# Altium schematic sheet RF_in_v2.SchDoc: Приемопередатчик  SDR200
size 420 x 297 mm; Author: В.Титов; DrawnBy: В.Титов; DocumentNumber: ХХХХ.468179.001 Э3; SheetNumber: 2; SheetTotal: 3; DocumentType: Схема электрическая принципиальная; Title2: Радиочастотная плата; Scale: 1:1
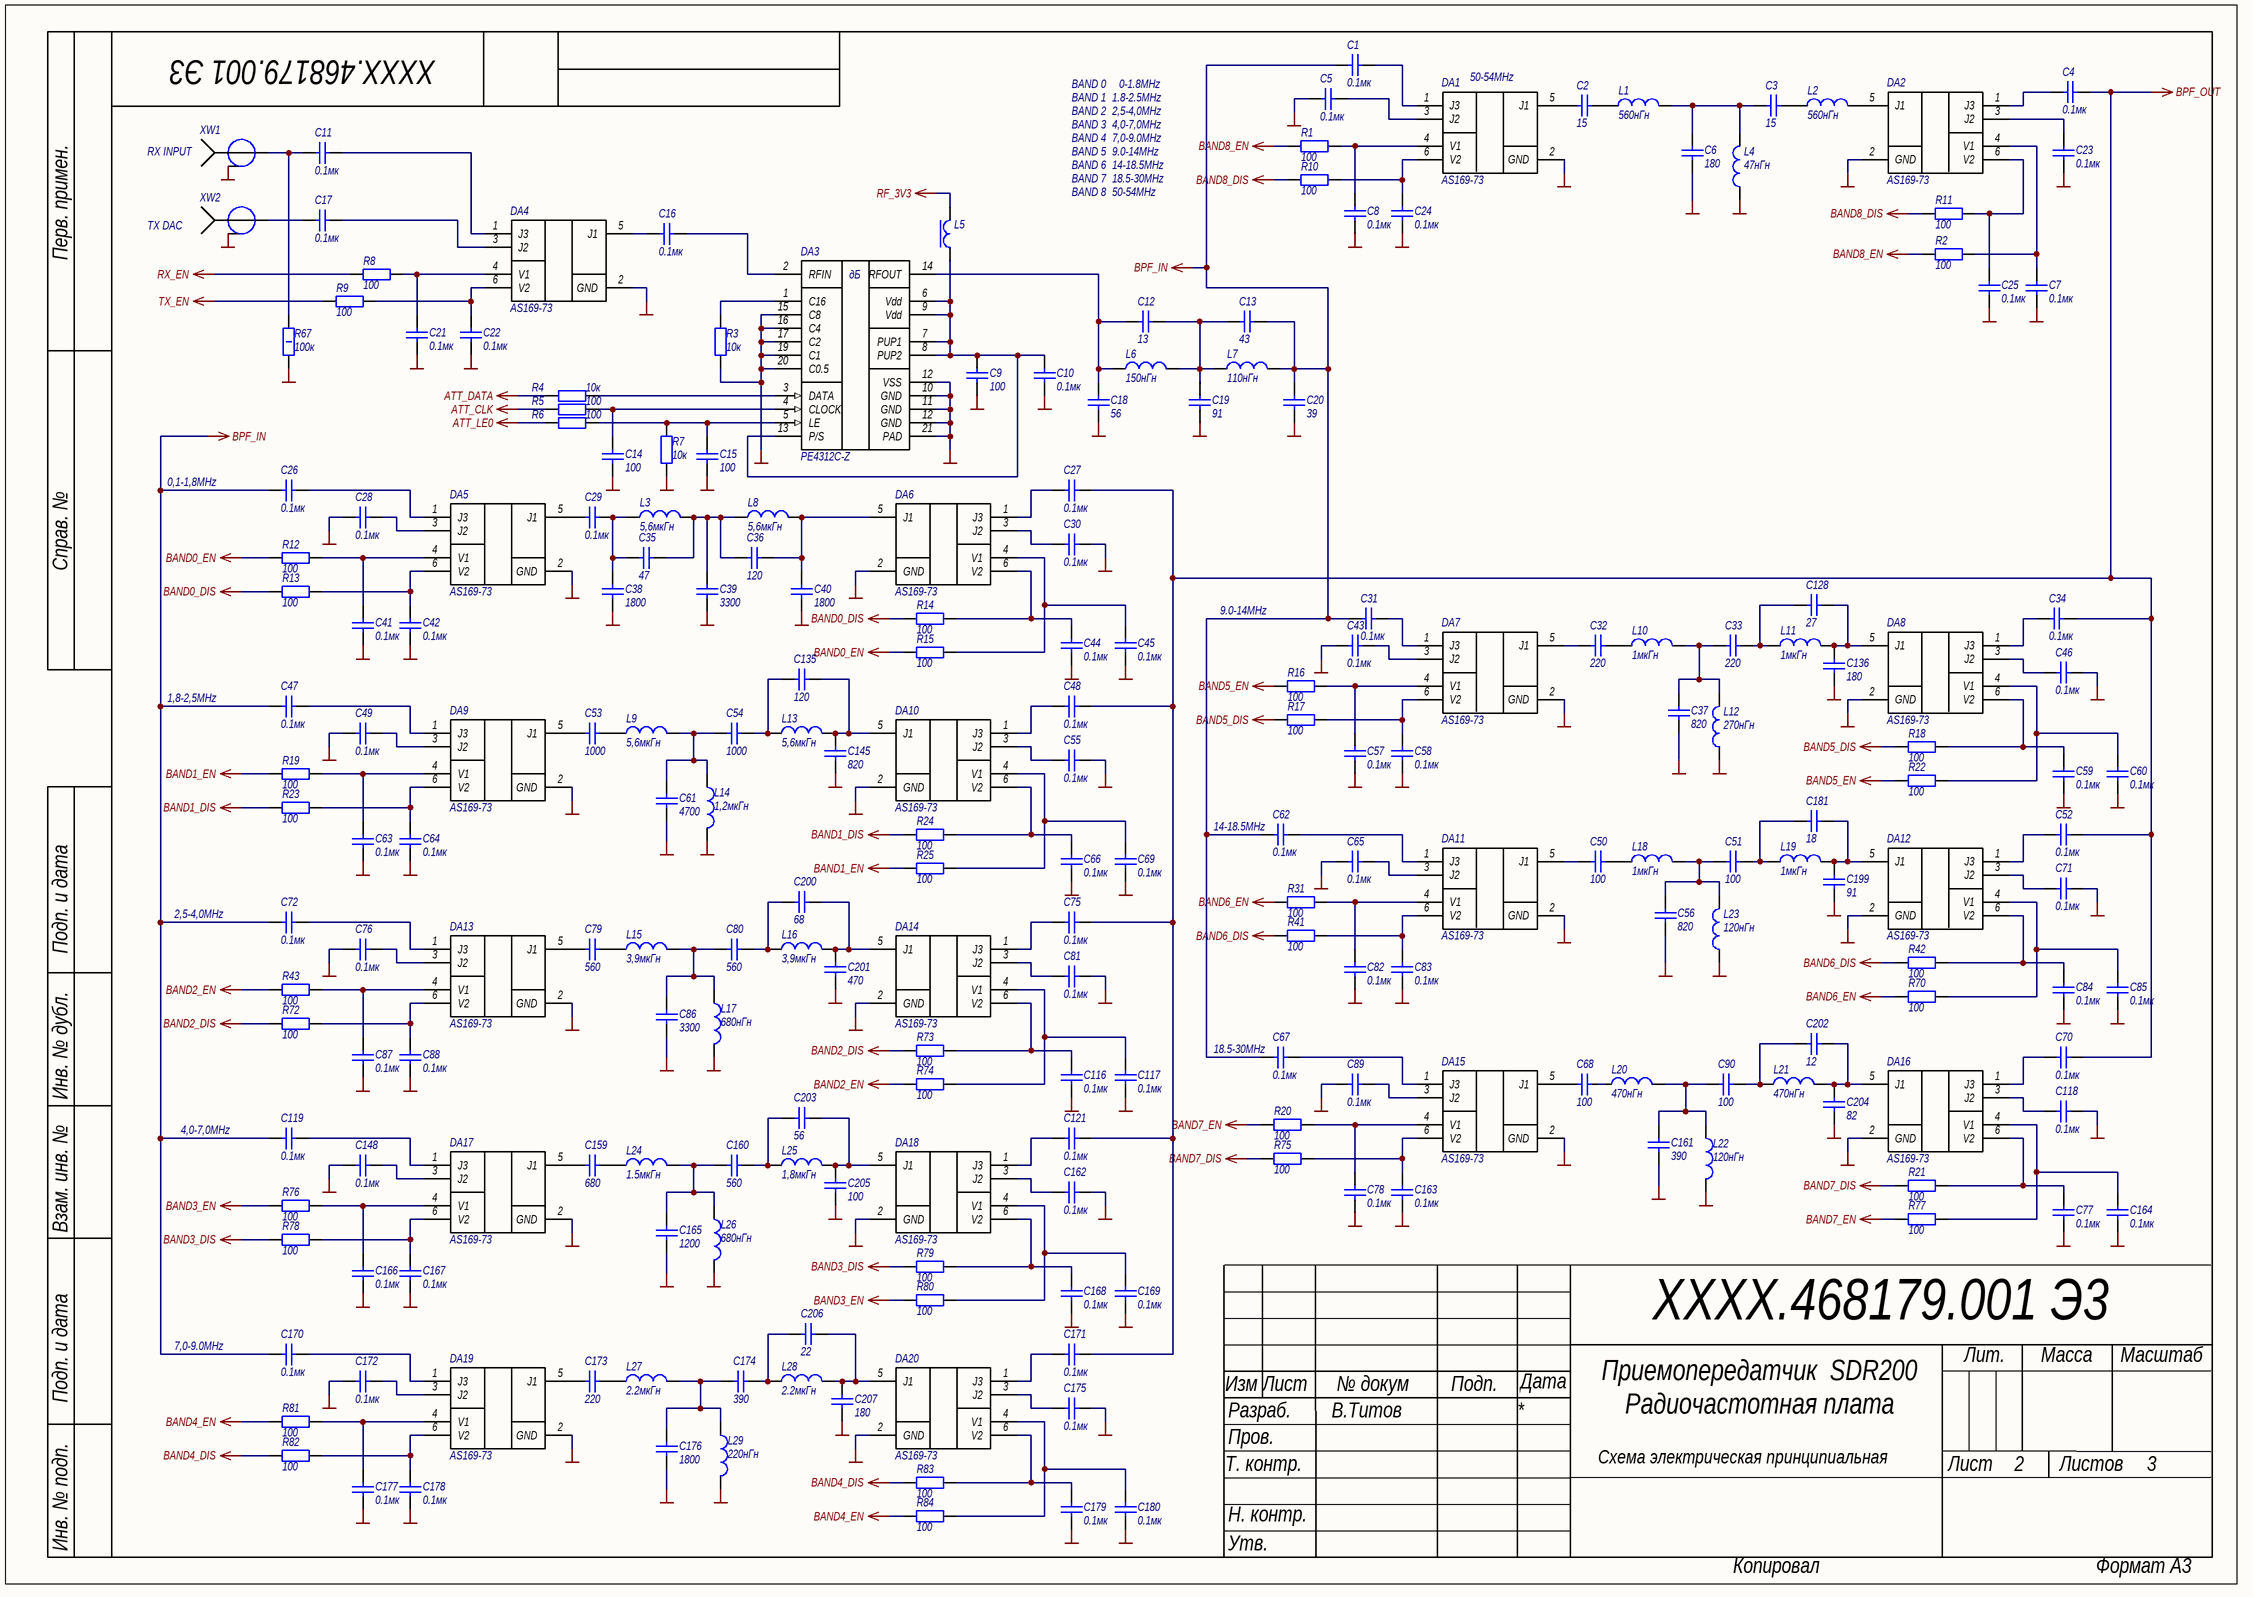
[diagram p0: RF_in_v2.SchDoc]

## Parts
C1  0.1мк  [CAPC1005X06N]
C2  15  [CAPC1005X06N]
C3  15  [CAPC1005X06N]
C4  0.1мк  [CAPC1005X06N]
C5  0.1мк  [CAPC1005X06N]
C6  180  [CAPC1005X06N]
C7  0.1мк  [CAPC1005X06N]
C8  0.1мк  [CAPC1005X06N]
C9  100  [CAPC1005X06N]
C10  0.1мк  [CAPC1005X06N]
C11  0.1мк  [CAPC1005X06N]
C12  13  [CAPC1005X06N]
C13  43  [CAPC1005X06N]
C14  100  [CAPC1005X06N]
C15  100  [CAPC1005X06N]
C16  0.1мк  [CAPC1005X06N]
C17  0.1мк  [CAPC1005X06N]
C18  56  [CAPC1005X06N]
C19  91  [CAPC1005X06N]
C20  39  [CAPC1005X06N]
C21  0.1мк  [CAPC1005X06N]
C22  0.1мк  [CAPC1005X06N]
C23  0.1мк  [CAPC1005X06N]
C24  0.1мк  [CAPC1005X06N]
C25  0.1мк  [CAPC1005X06N]
C26  0.1мк  [CAPC1005X06N]
C27  0.1мк  [CAPC1005X06N]
C28  0.1мк  [CAPC1005X06N]
C29  0.1мк  [CAPC1005X06N]
C30  0.1мк  [CAPC1005X06N]
C31  0.1мк  [CAPC1005X06N]
C32  220  [CAPC1005X06N]
C33  220  [CAPC1005X06N]
C34  0.1мк  [CAPC1005X06N]
C35  47  [CAPC1005X06N]
C36  120  [CAPC1005X06N]
C37  820  [CAPC1005X06N]
C38  1800  [CAPC1005X06N]
C39  3300  [CAPC1005X06N]
C40  1800  [CAPC1005X06N]
C41  0.1мк  [CAPC1005X06N]
C42  0.1мк  [CAPC1005X06N]
C43  0.1мк  [CAPC1005X06N]
C44  0.1мк  [CAPC1005X06N]
C45  0.1мк  [CAPC1005X06N]
C46  0.1мк  [CAPC1005X06N]
C47  0.1мк  [CAPC1005X06N]
C48  0.1мк  [CAPC1005X06N]
C49  0.1мк  [CAPC1005X06N]
C50  100  [CAPC1005X06N]
C51  100  [CAPC1005X06N]
C52  0.1мк  [CAPC1005X06N]
C53  1000  [CAPC1005X06N]
C54  1000  [CAPC1005X06N]
C55  0.1мк  [CAPC1005X06N]
C56  820  [CAPC1005X06N]
C57  0.1мк  [CAPC1005X06N]
C58  0.1мк  [CAPC1005X06N]
C59  0.1мк  [CAPC1005X06N]
C60  0.1мк  [CAPC1005X06N]
C61  4700  [CAPC1005X06N]
C62  0.1мк  [CAPC1005X06N]
C63  0.1мк  [CAPC1005X06N]
C64  0.1мк  [CAPC1005X06N]
C65  0.1мк  [CAPC1005X06N]
C66  0.1мк  [CAPC1005X06N]
C67  0.1мк  [CAPC1005X06N]
C68  100  [CAPC1005X06N]
C69  0.1мк  [CAPC1005X06N]
C70  0.1мк  [CAPC1005X06N]
C71  0.1мк  [CAPC1005X06N]
C72  0.1мк  [CAPC1005X06N]
C75  0.1мк  [CAPC1005X06N]
C76  0.1мк  [CAPC1005X06N]
C77  0.1мк  [CAPC1005X06N]
C78  0.1мк  [CAPC1005X06N]
C79  560  [CAPC1005X06N]
C80  560  [CAPC1005X06N]
C81  0.1мк  [CAPC1005X06N]
C82  0.1мк  [CAPC1005X06N]
C83  0.1мк  [CAPC1005X06N]
C84  0.1мк  [CAPC1005X06N]
C85  0.1мк  [CAPC1005X06N]
C86  3300  [CAPC1005X06N]
C87  0.1мк  [CAPC1005X06N]
C88  0.1мк  [CAPC1005X06N]
C89  0.1мк  [CAPC1005X06N]
C90  100  [CAPC1005X06N]
C116  0.1мк  [CAPC1005X06N]
C117  0.1мк  [CAPC1005X06N]
C118  0.1мк  [CAPC1005X06N]
C119  0.1мк  [CAPC1005X06N]
C121  0.1мк  [CAPC1005X06N]
C128  27  [CAPC1005X06N]
C135  120  [CAPC1005X06N]
C136  180  [CAPC1005X06N]
C145  820  [CAPC1005X06N]
C148  0.1мк  [CAPC1005X06N]
C159  680  [CAPC1005X06N]
C160  560  [CAPC1005X06N]
C161  390  [CAPC1005X06N]
C162  0.1мк  [CAPC1005X06N]
C163  0.1мк  [CAPC1005X06N]
C164  0.1мк  [CAPC1005X06N]
C165  1200  [CAPC1005X06N]
C166  0.1мк  [CAPC1005X06N]
C167  0.1мк  [CAPC1005X06N]
C168  0.1мк  [CAPC1005X06N]
C169  0.1мк  [CAPC1005X06N]
C170  0.1мк  [CAPC1005X06N]
C171  0.1мк  [CAPC1005X06N]
C172  0.1мк  [CAPC1005X06N]
C173  220  [CAPC1005X06N]
C174  390  [CAPC1005X06N]
C175  0.1мк  [CAPC1005X06N]
C176  1800  [CAPC1005X06N]
C177  0.1мк  [CAPC1005X06N]
C178  0.1мк  [CAPC1005X06N]
C179  0.1мк  [CAPC1005X06N]
C180  0.1мк  [CAPC1005X06N]
C181  18  [CAPC1005X06N]
C199  91  [CAPC1005X06N]
C200  68  [CAPC1005X06N]
C201  470  [CAPC1005X06N]
C202  12  [CAPC1005X06N]
C203  56  [CAPC1005X06N]
C204  82  [CAPC1005X06N]
C205  100  [CAPC1005X06N]
C206  22  [CAPC1005X06N]
C207  180  [CAPC1005X06N]
DA1  AS169-73  [SOT95P270X145-6N]
DA2  AS169-73  [SOT95P270X145-6N]
DA3  PE4312C-Z  [QFN50P400X400X80_HS-21L]
DA4  AS169-73  [SOT95P270X145-6N]
DA5  AS169-73  [SOT95P270X145-6N]
DA6  AS169-73  [SOT95P270X145-6N]
DA7  AS169-73  [SOT95P270X145-6N]
DA8  AS169-73  [SOT95P270X145-6N]
DA9  AS169-73  [SOT95P270X145-6N]
DA10  AS169-73  [SOT95P270X145-6N]
DA11  AS169-73  [SOT95P270X145-6N]
DA12  AS169-73  [SOT95P270X145-6N]
DA13  AS169-73  [SOT95P270X145-6N]
DA14  AS169-73  [SOT95P270X145-6N]
DA15  AS169-73  [SOT95P270X145-6N]
DA16  AS169-73  [SOT95P270X145-6N]
DA17  AS169-73  [SOT95P270X145-6N]
DA18  AS169-73  [SOT95P270X145-6N]
DA19  AS169-73  [SOT95P270X145-6N]
DA20  AS169-73  [SOT95P270X145-6N]
L1  560нГн  [INDC0805CS]
L2  560нГн  [INDC0805CS]
L3  5,6мкГн  [Coilcraft-1008CS]
L4  47нГн  [INDC0805CS]
L5  BLM18PG121SN1D  [INDC1608X08L]  (value not drawn)
L6  150нГн  [INDC0805CS]
L7  110нГн  [INDC0805CS]
L8  5,6мкГн  [Coilcraft-1008CS]
L9  5,6мкГн  [Coilcraft-1008CS]
L10  1мкГн  [INDC0805CS]
L11  1мкГн  [INDC0805CS]
L12  270нГн  [INDC0805CS]
L13  5,6мкГн  [Coilcraft-1008CS]
L14  1,2мкГн  [Coilcraft-1008CS]
L15  3,9мкГн  [Coilcraft-1008CS]
L16  3,9мкГн  [Coilcraft-1008CS]
L17  680нГн  [INDC0805CS]
L18  1мкГн  [INDC0805CS]
L19  1мкГн  [INDC0805CS]
L20  470нГн  [INDC0805CS]
L21  470нГн  [INDC0805CS]
L22  120нГн  [INDC0805CS]
L23  120нГн  [INDC0805CS]
L24  1.5мкГн  [INDC0805CS]
L25  1,8мкГн  [INDC0805CS]
L26  680нГн  [INDC0805CS]
L27  2.2мкГн  [INDC0805CS]
L28  2.2мкГн  [INDC0805CS]
L29  220нГн  [INDC0805CS]
R1  100  [RESC1005X06N]
R2  100  [RESC1005X06N]
R3  10к  [RESC1005X06N]
R4  10к  [RESC1005X06N]
R5  100  [RESC1005X06N]
R6  100  [RESC1005X06N]
R7  10к  [RESC1005X06N]
R8  100  [RESC1005X06N]
R9  100  [RESC1005X06N]
R10  100  [RESC1005X06N]
R11  100  [RESC1005X06N]
R12  100  [RESC1005X06N]
R13  100  [RESC1005X06N]
R14  100  [RESC1005X06N]
R15  100  [RESC1005X06N]
R16  100  [RESC1005X06N]
R17  100  [RESC1005X06N]
R18  100  [RESC1005X06N]
R19  100  [RESC1005X06N]
R20  100  [RESC1005X06N]
R21  100  [RESC1005X06N]
R22  100  [RESC1005X06N]
R23  100  [RESC1005X06N]
R24  100  [RESC1005X06N]
R25  100  [RESC1005X06N]
R31  100  [RESC1005X06N]
R41  100  [RESC1005X06N]
R42  100  [RESC1005X06N]
R43  100  [RESC1005X06N]
R67  100к  [RESC3216X04L]
R70  100  [RESC1005X06N]
R72  100  [RESC1005X06N]
R73  100  [RESC1005X06N]
R74  100  [RESC1005X06N]
R75  100  [RESC1005X06N]
R76  100  [RESC1005X06N]
R77  100  [RESC1005X06N]
R78  100  [RESC1005X06N]
R79  100  [RESC1005X06N]
R80  100  [RESC1005X06N]
R81  100  [RESC1005X06N]
R82  100  [RESC1005X06N]
R83  100  [RESC1005X06N]
R84  100  [RESC1005X06N]
XW1  SMA-JR  [SMA-JR]  (value not drawn)
XW2  SMA-JR  [SMA-JR]  (value not drawn)

## Nets
ATT_CLK: R5.2
ATT_DATA: R4.2
ATT_LE0: R6.2
BAND0_DIS: R13.2 R14.1
BAND0_EN: R12.2 R15.1
BAND1_DIS: R23.2 R24.1
BAND1_EN: R19.2 R25.1
BAND2_DIS: R72.2 R73.1
BAND2_EN: R43.2 R74.1
BAND3_DIS: R78.2 R79.1
BAND3_EN: R76.2 R80.1
BAND4_DIS: R82.2 R83.1
BAND4_EN: R81.2 R84.1
BAND5_DIS: R17.2 R18.1
BAND5_EN: R16.2 R22.1
BAND6_DIS: R41.2 R42.1
BAND6_EN: R31.2 R70.1
BAND7_DIS: R21.1 R75.2
BAND7_EN: R20.2 R77.1
BAND8_DIS: R10.2 R11.2
BAND8_EN: R1.2 R2.2
BPF_IN: C1.2 C13.1 C20.2 C26.2 C31.2 C47.2 C62.2 C67.2 C72.2 C119.2 C170.2 L7.2
BPF_OUT: C4.1 C27.1 C34.1 C48.1 C52.1 C70.1 C75.1 C121.1 C171.1
GND: C5.2 C6.1 C7.2 C8.2 C9.1 C10.1 C14.1 C15.1 C18.1 C19.1 C20.1 C21.2 C22.2 C23.2 C24.2 C25.2 C28.2 C30.1 C37.1 C38.1 C39.1 C40.1 C41.2 C42.2 C43.2 C44.2 C45.2 C46.1 C49.2 C55.1 C56.1 C57.2 C58.2 C59.2 C60.2 C61.1 C63.2 C64.2 C65.2 C66.2 C69.2 C71.1 C76.2 C77.2 C78.2 C81.1 C82.2 C83.2 C84.2 C85.2 C86.1 C87.2 C88.2 C89.2 C116.2 C117.2 C118.1 C136.1 C145.1 C148.2 C161.1 C162.1 C163.2 C164.2 C165.1 C166.2 C167.2 C168.2 C169.2 C172.2 C175.1 C176.1 C177.2 C178.2 C179.2 C180.2 C199.1 C201.1 C204.1 C205.1 C207.1 DA1.2(GND) DA2.2(GND) DA3.10(GND) DA3.11(GND) DA3.12(VSS) DA3.15(C8) DA3.16(C4) DA3.17(C2) DA3.19(C1) DA3.20(C0.5) DA3.21(PAD) DA4.2(GND) DA5.2(GND) DA6.2(GND) DA7.2(GND) DA8.2(GND) DA9.2(GND) DA10.2(GND) DA11.2(GND) DA12.2(GND) DA13.2(GND) DA14.2(GND) DA15.2(GND) DA16.2(GND) DA17.2(GND) DA18.2(GND) DA19.2(GND) DA20.2(GND) L4.1 L12.1 L14.2 L17.2 L22.2 L23.1 L26.2 L29.2 R3.1 R7.2 R67.2 XW1.2 XW2.2
RF_3V3: L5.2
RX_EN: R8.2
TX_EN: R9.2
NetC1_1: C1.1 DA1.1(J3)
NetC2_1: C2.1 DA1.5(GND)
NetC2_2: C2.2 L1.1
NetC3_1: C3.1 C6.2 L1.2 L4.2
NetC3_2: C3.2 L2.1
NetC4_2: C4.2 DA2.1(J3)
NetC5_1: C5.1 DA1.3(J2)
NetC7_1: C7.1 DA2.4(V1) R2.1
NetC8_1: C8.1 DA1.4(V1) R1.1
NetC9_2: C9.2 C10.2 DA3.6(Vdd) DA3.7(PUP1) DA3.8(PUP2) DA3.9(Vdd) DA3.13(P/S) L5.1
NetC11_1: C11.1 DA4.1(J3)
NetC11_2: C11.2 R67.1 XW1.1
NetC12_1: C12.1 C13.2 C19.2 L6.2 L7.1
NetC12_2: C12.2 C18.2 DA3.14(RFOUT) L6.1
NetC14_2: C14.2 DA3.4(CLOCK) R5.1
NetC15_2: C15.2 DA3.5(LE) R6.1 R7.1
NetC16_1: C16.1 DA3.2(RFIN)
NetC16_2: C16.2 DA4.5(GND)
NetC17_1: C17.1 DA4.3(J2)
NetC17_2: C17.2 XW2.1
NetC21_1: C21.1 DA4.4(V1) R8.1
NetC22_1: C22.1 DA4.6(V2) R9.1
NetC23_1: C23.1 DA2.3(J2)
NetC24_1: C24.1 DA1.6(V2) R10.1
NetC25_1: C25.1 DA2.6(V2) R11.1
NetC26_1: C26.1 DA5.1(J3)
NetC27_2: C27.2 DA6.1(J3)
NetC28_1: C28.1 DA5.3(J2)
NetC29_1: C29.1 C35.1 C38.2 L3.1
NetC29_2: C29.2 DA5.5(GND)
NetC30_2: C30.2 DA6.3(J2)
NetC31_1: C31.1 DA7.1(J3)
NetC32_1: C32.1 DA7.5(GND)
NetC32_2: C32.2 L10.1
NetC33_1: C33.1 C37.2 L10.2 L12.2
NetC33_2: C33.2 C128.1 L11.1
NetC34_2: C34.2 DA8.1(J3)
NetC35_2: C35.2 C36.1 C39.2 L3.2 L8.1
NetC36_2: C36.2 C40.2 DA6.5(GND) L8.2
NetC41_1: C41.1 DA5.4(V1) R12.1
NetC42_1: C42.1 DA5.6(V2) R13.1
NetC43_1: C43.1 DA7.3(J2)
NetC44_1: C44.1 DA6.6(V2) R14.2
NetC45_1: C45.1 DA6.4(V1) R15.2
NetC46_2: C46.2 DA8.3(J2)
NetC47_1: C47.1 DA9.1(J3)
NetC48_2: C48.2 DA10.1(J3)
NetC49_1: C49.1 DA9.3(J2)
NetC50_1: C50.1 DA11.5(GND)
NetC50_2: C50.2 L18.1
NetC51_1: C51.1 C56.2 L18.2 L23.2
NetC51_2: C51.2 C181.1 L19.1
NetC52_2: C52.2 DA12.1(J3)
NetC53_1: C53.1 DA9.5(GND)
NetC53_2: C53.2 L9.1
NetC54_1: C54.1 C61.2 L9.2 L14.1
NetC54_2: C54.2 C135.1 L13.1
NetC55_2: C55.2 DA10.3(J2)
NetC57_1: C57.1 DA7.4(V1) R16.1
NetC58_1: C58.1 DA7.6(V2) R17.1
NetC59_1: C59.1 DA8.6(V2) R18.2
NetC60_1: C60.1 DA8.4(V1) R22.2
NetC62_1: C62.1 DA11.1(J3)
NetC63_1: C63.1 DA9.4(V1) R19.1
NetC64_1: C64.1 DA9.6(V2) R23.1
NetC65_1: C65.1 DA11.3(J2)
NetC66_1: C66.1 DA10.6(V2) R24.2
NetC67_1: C67.1 DA15.1(J3)
NetC68_1: C68.1 DA15.5(GND)
NetC68_2: C68.2 L20.1
NetC69_1: C69.1 DA10.4(V1) R25.2
NetC70_2: C70.2 DA16.1(J3)
NetC71_2: C71.2 DA12.3(J2)
NetC72_1: C72.1 DA13.1(J3)
NetC75_2: C75.2 DA14.1(J3)
NetC76_1: C76.1 DA13.3(J2)
NetC77_1: C77.1 DA16.6(V2) R21.2
NetC78_1: C78.1 DA15.4(V1) R20.1
NetC79_1: C79.1 DA13.5(GND)
NetC79_2: C79.2 L15.1
NetC80_1: C80.1 C86.2 L15.2 L17.1
NetC80_2: C80.2 C200.1 L16.1
NetC81_2: C81.2 DA14.3(J2)
NetC82_1: C82.1 DA11.4(V1) R31.1
NetC83_1: C83.1 DA11.6(V2) R41.1
NetC84_1: C84.1 DA12.6(V2) R42.2
NetC85_1: C85.1 DA12.4(V1) R70.2
NetC87_1: C87.1 DA13.4(V1) R43.1
NetC88_1: C88.1 DA13.6(V2) R72.1
NetC89_1: C89.1 DA15.3(J2)
NetC90_1: C90.1 C161.2 L20.2 L22.1
NetC90_2: C90.2 C202.1 L21.1
NetC116_1: C116.1 DA14.6(V2) R73.2
NetC117_1: C117.1 DA14.4(V1) R74.2
NetC118_2: C118.2 DA16.3(J2)
NetC119_1: C119.1 DA17.1(J3)
NetC121_2: C121.2 DA18.1(J3)
NetC128_2: C128.2 C136.2 DA8.5(GND) L11.2
NetC135_2: C135.2 C145.2 DA10.5(GND) L13.2
NetC148_1: C148.1 DA17.3(J2)
NetC159_1: C159.1 DA17.5(GND)
NetC159_2: C159.2 L24.1
NetC160_1: C160.1 C165.2 L24.2 L26.1
NetC160_2: C160.2 C203.1 L25.1
NetC162_2: C162.2 DA18.3(J2)
NetC163_1: C163.1 DA15.6(V2) R75.1
NetC164_1: C164.1 DA16.4(V1) R77.2
NetC166_1: C166.1 DA17.4(V1) R76.1
NetC167_1: C167.1 DA17.6(V2) R78.1
NetC168_1: C168.1 DA18.6(V2) R79.2
NetC169_1: C169.1 DA18.4(V1) R80.2
NetC170_1: C170.1 DA19.1(J3)
NetC171_2: C171.2 DA20.1(J3)
NetC172_1: C172.1 DA19.3(J2)
NetC173_1: C173.1 DA19.5(GND)
NetC173_2: C173.2 L27.1
NetC174_1: C174.1 C176.2 L27.2 L29.1
NetC174_2: C174.2 C206.1 L28.1
NetC175_2: C175.2 DA20.3(J2)
NetC177_1: C177.1 DA19.4(V1) R81.1
NetC178_1: C178.1 DA19.6(V2) R82.1
NetC179_1: C179.1 DA20.6(V2) R83.2
NetC180_1: C180.1 DA20.4(V1) R84.2
NetC181_2: C181.2 C199.2 DA12.5(GND) L19.2
NetC200_2: C200.2 C201.2 DA14.5(GND) L16.2
NetC202_2: C202.2 C204.2 DA16.5(GND) L21.2
NetC203_2: C203.2 C205.2 DA18.5(GND) L25.2
NetC206_2: C206.2 C207.2 DA20.5(GND) L28.2
NetDA2_5: DA2.5(GND) L2.2
NetDA3_1: DA3.1(C16) R3.2
NetDA3_3: DA3.3(DATA) R4.1

## Notes on the sheet
- BAND 0
- BAND 1
- BAND 2
- BAND 3
- 1.8-2.5MHz
- 2,5-4,0MHz
- 4,0-7,0MHz
- 0-1.8MHz
- (near DA1) 50-54MHz
- (near XW1) RX INPUT
- BAND 4
- BAND 5
- BAND 6
- BAND 7
- 7,0-9.0MHz
- 9.0-14MHz
- 14-18.5MHz
- 18.5-30MHz
- TX DAC
- BAND 8
- 50-54MHz
- 0,1-1,8MHz
- 1,8-2,5MHz
- (near C62) 14-18.5MHz
- (near C72) 2,5-4,0MHz
- (near C67) 18.5-30MHz
- (near C119) 4,0-7,0MHz
- (near C170) 7,0-9.0MHz
- Перв. примен.
- Справ. №
- Подп. и дата
- Инв. № дубл.
- Взам. инв. №
- Изм
- Лист
- № докум
- Подп.
- Дата
- Лит.
- Масса
- Масштаб
- Т. контр.
- Разраб.
- Пров.
- Листов
- Н. контр.
- Инв. № подп.
- Утв.
- Копировал
- Формат А3
- (in symbol Микросхема PE4312C-Z) дБ

## Library data of the parts
C1 C4 C5 C7 C8 C10 C11 C16 C17 C21-C31 C34 C41-C49 C52 C55 C57-C60 C62-C67 C69-C72 C75-C78 C81-C85 C87-C89 C116-C119 C121 C148 C162-C164 C166-C172 C175 C177-C180 = Кер.ЧИП конд. 0402 0.1мкФ X7R 10%, 16В: Кер. ЧИП-конденсатор; Power/Voltage: 16В; TKE: X7R; Tolerance: ±10%; PackageReference: 0402; Value: 0.1мк
C2 C3 = Кер.ЧИП конд. 0402 15пФ NPO 5%, 50В: Кер. ЧИП-конденсатор; Power/Voltage: 50В; TKE: NPO; Tolerance: ±5%; Value: 15; PackageReference: 0402
C6 C136 C207 = Кер.ЧИП конд. 0402 180пФ NPO 5%, 50В: Кер. ЧИП-конденсатор; Power/Voltage: 50В; TKE: NPO; Tolerance: ±5%; Value: 180; PackageReference: 0402
C9 C14 C15 C50 C51 C68 C90 C205 = Кер.ЧИП конд. 0402 100пФ NPO 5%, 50В: Кер. ЧИП-конденсатор; Power/Voltage: 50В; TKE: NPO; Tolerance: ±5%; PackageReference: 0402; Value: 100
C12 = Кер.ЧИП конд. 0402 13пФ NPO 5%, 50В: Кер. ЧИП-конденсатор; Power/Voltage: 50В; TKE: NPO; Tolerance: ±5%; PackageReference: 0402; Value: 13
C13 = Кер.ЧИП конд. 0402 43пФ NPO 5%, 50В: Кер. ЧИП-конденсатор; Power/Voltage: 50В; TKE: NPO; Tolerance: ±5%; PackageReference: 0402; Value: 43
C18 C203 = Кер.ЧИП конд. 0402 56пФ NPO 5%, 50В: Кер. ЧИП-конденсатор; Power/Voltage: 50В; TKE: NPO; Tolerance: ±5%; PackageReference: 0402; Value: 56
C19 C199 = Кер.ЧИП конд. 0402 91пФ NPO 5%, 50В: Кер. ЧИП-конденсатор; Power/Voltage: 50В; TKE: NPO; Tolerance: ±5%; PackageReference: 0402; Value: 91
C20 = Кер.ЧИП конд. 0402 39пФ NPO 5%, 50В: Кер. ЧИП-конденсатор; Power/Voltage: 50В; TKE: NPO; Tolerance: ±5%; PackageReference: 0402; Value: 39
C32 C33 C173 = Кер.ЧИП конд. 0402 220пФ NPO 5%, 50В: Кер. ЧИП-конденсатор; Power/Voltage: 50В; TKE: NPO; Tolerance: ±5%; Value: 220; PackageReference: 0402
C35 = Кер.ЧИП конд. 0402 47пФ NPO 5%, 50В: Кер. ЧИП-конденсатор; Power/Voltage: 50В; TKE: NPO; Tolerance: ±5%; Value: 47; PackageReference: 0402
C36 C135 = Кер.ЧИП конд. 0402 120пФ NPO 5%, 50В: Кер. ЧИП-конденсатор; Power/Voltage: 50В; TKE: NPO; Tolerance: ±5%; Value: 120; PackageReference: 0402
C37 C56 C145 = Кер.ЧИП конд. 0402 820пФ NP0 5%, 50В: Кер. ЧИП-конденсатор; Power/Voltage: 50В; TKE: NPO; Tolerance: ±5%; Value: 820; PackageReference: 0402
C38 C40 C176 = Кер.ЧИП конд. 0402 1800пФ X7R 10%, 50В: Кер. ЧИП-конденсатор; Power/Voltage: 50В; TKE: X7R; Tolerance: ±20%; Value: 1800
C39 C86 = Кер.ЧИП конд. 0402 3300пФ X7R 10%, 50В: Кер. ЧИП-конденсатор; Power/Voltage: 50В; TKE: X7R; Tolerance: ±20%; Value: 3300
C53 C54 = Кер.ЧИП конд. 0402 1000пФ NP0 5%, 50В: Кер. ЧИП-конденсатор; Power/Voltage: 50В; TKE: NPO; Tolerance: ±5%; Value: 1000; PackageReference: 0402
C61 = Кер.ЧИП конд. 0402 4700пФ X7R 10%, 50В: Кер. ЧИП-конденсатор; Power/Voltage: 50В; TKE: X7R; Tolerance: ±20%; Value: 4700
C79 C80 C160 = Кер.ЧИП конд. 0402 560пФ NP0 5%, 50В: Кер. ЧИП-конденсатор; Power/Voltage: 50В; TKE: NPO; Tolerance: ±5%; Value: 560; PackageReference: 0402
C128 = Кер.ЧИП конд. 0402 27пФ NPO 5%, 50В: Кер. ЧИП-конденсатор; Power/Voltage: 50В; TKE: NPO; Tolerance: ±5%; Value: 27; PackageReference: 0402
C159 = Кер.ЧИП конд. 0402 680пФ NP0 5%, 50В: Кер. ЧИП-конденсатор; Power/Voltage: 50В; TKE: NPO; Tolerance: ±5%; Value: 680; PackageReference: 0402
C161 C174 = Кер.ЧИП конд. 0402 390пФ NP0 5%, 50В: Кер. ЧИП-конденсатор; Power/Voltage: 50В; TKE: NPO; Tolerance: ±5%; Value: 390; PackageReference: 0402
C165 = Кер.ЧИП конд. 0402 1200пФ X7R 10%, 50В: Кер. ЧИП-конденсатор; Power/Voltage: 50В; TKE: X7R; Tolerance: ±20%; Value: 1200
C181 = Кер.ЧИП конд. 0402 18пФ NPO 5%, 50В: Кер. ЧИП-конденсатор; Power/Voltage: 50В; TKE: NPO; Tolerance: ±5%; Value: 18; PackageReference: 0402
C200 = Кер.ЧИП конд. 0402 68пФ NPO 5%, 50В: Кер. ЧИП-конденсатор; Power/Voltage: 50В; TKE: NPO; Tolerance: ±5%; Value: 68; PackageReference: 0402
C201 = Кер.ЧИП конд. 0402 470пФ NP0 5%, 50В: Кер. ЧИП-конденсатор; Power/Voltage: 50В; TKE: NPO; Tolerance: ±5%; Value: 470; PackageReference: 0402
C202 = Кер.ЧИП конд. 0402 12пФ NPO 5%, 50В: Кер. ЧИП-конденсатор; Power/Voltage: 50В; TKE: NPO; Tolerance: ±5%; Value: 12; PackageReference: 0402
C204 = Кер.ЧИП конд. 0402 82пФ NPO 5%, 50В: Кер. ЧИП-конденсатор; Power/Voltage: 50В; TKE: NPO; Tolerance: ±5%; Value: 82; PackageReference: 0402
C206 = Кер.ЧИП конд. 0402 22пФ NPO 5%, 50В: Кер. ЧИП-конденсатор; Power/Voltage: 50В; TKE: NPO; Tolerance: ±5%; Value: 22; PackageReference: 0402
DA1 DA2 DA4-DA20 = Микросхема AS169-73: PHEMT GaAs IC SPDT Switch 300 kHz–2.5 GHz; Manufacturer: Qorvo; Value: AS169-73; ComponentLink1Description: product page; ComponentLink1URL: https://www.skyworksinc.com/Products/switches/AS169-73LF
DA3 = Микросхема PE4312C-Z: RF Digital Step Attenuator 6-bit, 31.5 dB, 1 MHz–4 GHz; Manufacturer: Peregrine; Value: PE4312C-Z; ComponentLink1Description: datasheet; ComponentLink1URL: https://www.psemi.com/pdf/datasheets/pe4312ds.pdf
L1 L2 = ЧИП индуктивность 0805CS-561X: Value: 560нГн
L3 L8 L9 L13 = ЧИП индуктивность 1008CS-562X_: Chip Inductors–1008CS Series (2520); Manufacturer: Сoilcraft; ManufacturerPartNumber: 1008CS-562X_E_; Value: 5,6мкГн
L4 = ЧИП индуктивность 0805CS-470X: Value: 47нГн
L5 = ЧИП дроссель 0603 BLM18PG121SN1D: SMD EMI Suppression Filter EMIFIL; Manufacturer: Murata; ManufacturerPartNumber: BLM18PG121SN1D; Value: BLM18PG121SN1D
L6 = ЧИП индуктивность 0805CS-151XGL: Value: 150нГн
L7 = ЧИП индуктивность 0805CS-111XGL: Value: 110нГн
L10 L11 L18 L19 = ЧИП индуктивность 0805CS-102X: Value: 1мкГн
L12 = ЧИП индуктивность 0805CS-271X: Value: 270нГн
L14 = ЧИП индуктивность 1008CS-122X: Chip Inductors–1008CS Series (2520); Manufacturer: Сoilcraft; Value: 1,2мкГн; ManufacturerPartNumber: 1008CS-122X
L15 = ЧИП индуктивность 1008CS-392X: Chip Inductors–1008CS Series (2520); Manufacturer: Сoilcraft; ManufacturerPartNumber: 1008CS-391X_E_; Value: 3,9мкГн
L16 = ЧИП индуктивность 1008CS-392X: Chip Inductors–1008CS Series (2520); Manufacturer: Сoilcraft; ManufacturerPartNumber: 1008CS-392X_E_; Value: 3,9мкГн
L17 L26 = ЧИП индуктивность 0805CS-681X: Value: 680нГн
L20 L21 = ЧИП индуктивность 0805CS-471X: Value: 470нГн
L22 L23 = ЧИП индуктивность 0805CS-121X: Value: 120нГн
L24 = ЧИП индуктивность 0805CS-152X: Value: 1.5мкГн
L25 = ЧИП индуктивность 0805CS-182X: Chip Inductors – 0805CS (2012); Manufacturer: Сoilcraft; ManufacturerPartNumber: 1812PS-683KLC; Value: 1,8мкГн
L27 L28 = ЧИП индуктивность 0805CS-222X: Value: 2.2мкГн
L29 = ЧИП индуктивность 0805CS-221XGL: Value: 220нГн
R1 R2 R5 R6 R8-R25 R31 R41-R43 R70 R72-R84 = Чип резистор 0402 100 Ом, 5%: ЧИП-резистор; Tolerance: ±5%; TKE: 100 ppm/°С; PackageReference: 0402; Value: 100
R3 R4 R7 = Чип резистор 0402 10 кОм, 5%: ЧИП-резистор; Tolerance: ±5%; TKE: 100 ppm/°С; PackageReference: 0402; Value: 10к
R67 = Чип резистор 1206 100 кОм, 5%: ЧИП-резистор; Manufacturer: ROHM; Tolerance: ±5%; TKE: 300 ppm/°С; PackageReference: 1206; Value: 100к
XW1 XW2 = Соединитель коаксиальный SMA-JR: SMA-JR Разъем SMA гнездо на плату, прямой угол; Value: SMA-JR; ComponentLink1Description: datasheet; ComponentLink1URL: http://www.brownbear.ru/goods/2243.html